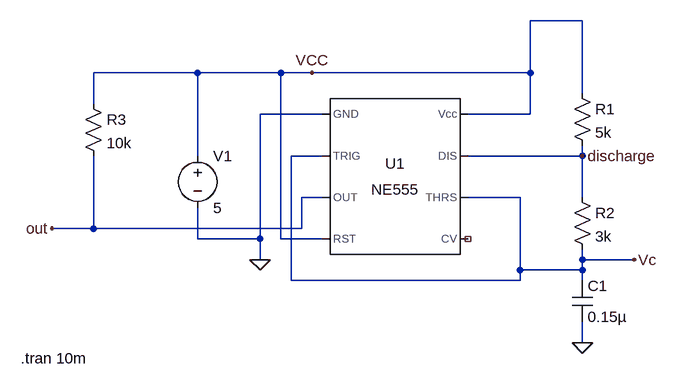
[diagram p0: schematic AstableMultivibrator555.asc]
AstableMultivibrator555.asc, the LTspice schematic file:
Version 4.1
SHEET 1 880 680
WIRE 528 -48 448 -48
WIRE -64 32 -224 32
WIRE 64 32 -64 32
WIRE 112 32 64 32
WIRE 448 32 448 -48
WIRE 448 32 112 32
WIRE 528 64 528 -48
WIRE -224 80 -224 32
WIRE 128 96 32 96
WIRE 448 96 448 32
WIRE 448 96 352 96
WIRE -64 160 -64 32
WIRE 128 160 80 160
WIRE 528 160 528 144
WIRE 528 160 352 160
WIRE 128 224 96 224
WIRE 432 224 352 224
WIRE 528 224 528 160
WIRE -224 272 -224 160
WIRE -224 272 -288 272
WIRE 96 272 96 224
WIRE 96 272 -224 272
WIRE -64 288 -64 240
WIRE 32 288 32 96
WIRE 32 288 -64 288
WIRE 64 288 64 32
WIRE 128 288 64 288
WIRE 32 320 32 288
WIRE 528 320 528 304
WIRE 608 320 528 320
WIRE 432 336 432 224
WIRE 528 336 528 320
WIRE 528 336 432 336
WIRE 80 352 80 160
WIRE 432 352 432 336
WIRE 432 352 80 352
WIRE 528 352 528 336
WIRE 528 448 528 416
FLAG 32 320 0
FLAG 528 448 0
FLAG 112 32 VCC
FLAG -288 272 out
FLAG 528 160 discharge
FLAG 608 320 Vc
SYMBOL Misc\\NE555 240 192 R0
SYMATTR InstName U1
SYMBOL voltage -64 144 R0
WINDOW 123 0 0 Left 0
WINDOW 39 0 0 Left 0
SYMATTR InstName V1
SYMATTR Value 5
SYMBOL res 512 48 R0
SYMATTR InstName R1
SYMATTR Value 5k
SYMBOL res 512 208 R0
SYMATTR InstName R2
SYMATTR Value 3k
SYMBOL cap 512 352 R0
SYMATTR InstName C1
SYMATTR Value 0.15µ
SYMBOL res -240 64 R0
SYMATTR InstName R3
SYMATTR Value 10k
TEXT -336 472 Left 2 !.tran 10m

The netlist it stands for:
* AstableMultivibrator555.asc
X§U1 0 Vc out VCC NC_01 Vc discharge VCC NE555  ; pins GND TRIG OUT RST CV THRS DIS Vcc
V1 VCC 0 5
R1 VCC discharge 5k
R2 discharge Vc 3k
C1 Vc 0 0.15µ
R3 VCC out 10k
.tran 10m
.lib NE555.sub
.backanno
.end